# EAGLE design Controller_v4 (EAGLE 6.4)
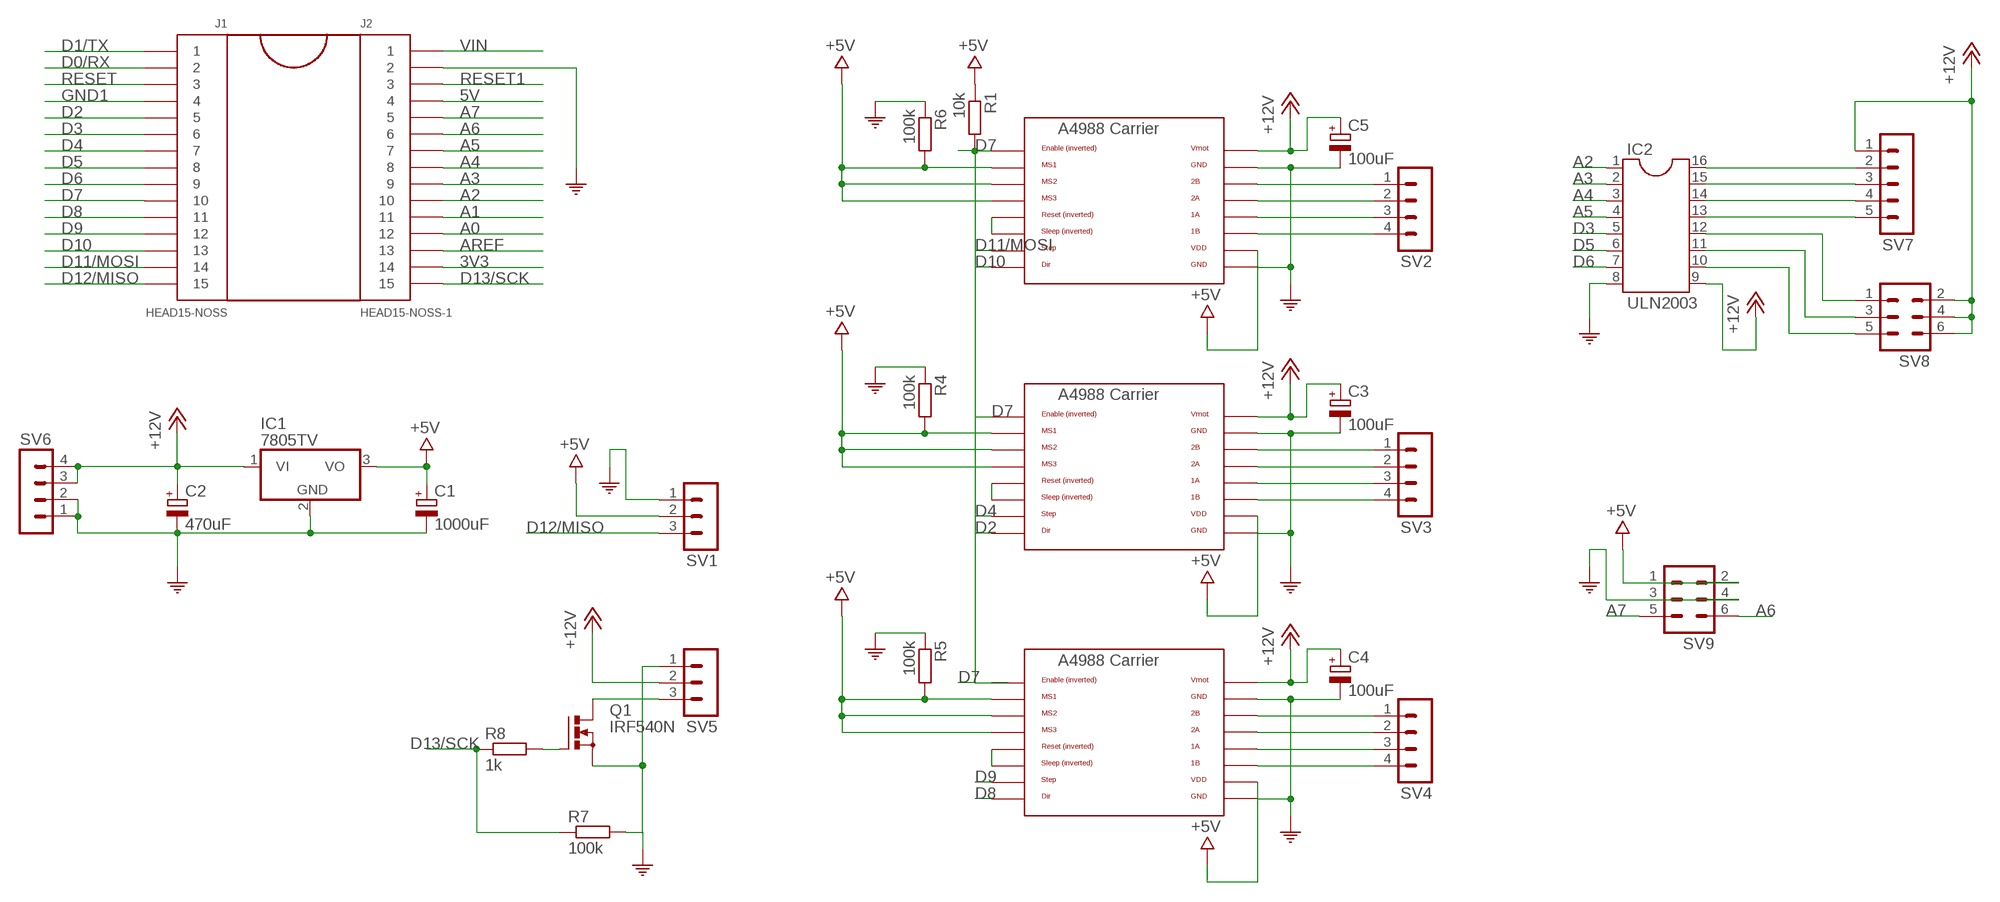
[diagram p0: schematic, sheet 1]

## Parts
C1  1000uF  CPOL-EUTAP5-70  [TAP5-70]
C2  470uF  CPOL-EUTAP5-70  [TAP5-70]
C3  100uF  CPOL-EUTAP5-70  [TAP5-70]
C4  100uF  CPOL-EUTAP5-70  [TAP5-70]
C5  100uF  CPOL-EUTAP5-70  [TAP5-70]
IC1  7805TV  [TO220V]
IC2  ULN2003  DIL16  [DIL16]
J1  HEAD15-NOSS  [HEAD15-NOSS]
J2  HEAD15-NOSS-1  [HEAD15-NOSS-1]
Q1  IRF540N  PMOSFET_NTO220BV  [TO220BV]
R1  10k  R-EU_0207/10  [0207/10]
R4  100k  R-EU_0207/10  [0207/10]
R5  100k  R-EU_0207/10  [0207/10]
R6  100k  R-EU_0207/10  [0207/10]
R7  100k  R-EU_0207/10  [0207/10]
R8  1k  R-EU_0207/10  [0207/10]
SV1  MA03-1  [MA03-1]
SV2  MA04-1  [MA04-1]
SV3  MA04-1  [MA04-1]
SV4  MA04-1  [MA04-1]
SV5  MA03-1  [MA03-1]
SV6  MA04-1  [MA04-1]
SV7  MA05-1  [MA05-1]
SV8  MA03-2  [MA03-2]
SV9  MA03-2  [MA03-2]
U$3  A4988BREAKOUT  [A4988BREAKOUT]
U$4  A4988BREAKOUT  [A4988BREAKOUT]
U$5  A4988BREAKOUT  [A4988BREAKOUT]

## Nets
3V3: J2.14
5V: J2.4
+5V: C1.+ IC1.3(VO) R1.1 R4.2 R5.2 R6.2 SV1.2 SV9.1 SV9.2 U$3.MS1 U$3.MS2 U$3.MS3 U$3.VDD U$4.MS1 U$4.MS2 U$4.MS3 U$4.VDD U$5.MS1 U$5.MS2 U$5.MS3 U$5.VDD
+12V: C2.+ C3.+ C4.+ C5.+ IC1.1(VI) IC2.9 SV5.2 SV6.3 SV6.4 SV7.1 SV8.2 SV8.4 SV8.6 U$3.VMOT U$4.VMOT U$5.VMOT
A0: J2.12
A1: J2.11
A2: IC2.1 J2.10
A3: IC2.2 J2.9
A4: IC2.3 J2.8
A5: IC2.4 J2.7
A6: J2.6 SV9.6
A7: J2.5 SV9.5
AREF: J2.13
COM: C1.- C2.- C3.- C4.- C5.- IC1.2(GND) IC2.8 J2.2 Q1.S R4.1 R5.1 R6.1 R7.2 SV1.1 SV5.1 SV6.1 SV6.2 SV9.3 SV9.4 U$3.GND U$3.GND@0(GND) U$4.GND U$4.GND@0(GND) U$5.GND U$5.GND@0(GND)
D0/RX: J1.2
D1/TX: J1.1
D2: J1.5 U$5.DIR
D3: IC2.5 J1.6
D4: J1.7 U$5.STEP
D5: IC2.6 J1.8
D6: IC2.7 J1.9
D7: J1.10 R1.2 U$3.EN U$4.EN U$5.EN
D8: J1.11 U$4.DIR
D9: J1.12 U$4.STEP
D10: J1.13 U$3.DIR
D11/MOSI: J1.14 U$3.STEP
D12/MISO: J1.15 SV1.3
D13/SCK: J2.15 R7.1 R8.1
GND1: J1.4
N$4: U$4.RST U$4.SLP(SLEEP)
N$5: SV2.1 U$3.2B
N$6: U$3.RST U$3.SLP(SLEEP)
N$7: U$5.RST U$5.SLP(SLEEP)
N$8: SV2.2 U$3.2A
N$10: SV2.3 U$3.1A
N$11: SV2.4 U$3.1B
N$12: SV3.1 U$5.2B
N$13: SV3.2 U$5.2A
N$14: SV3.3 U$5.1A
N$15: SV3.4 U$5.1B
N$16: SV4.1 U$4.2B
N$17: SV4.2 U$4.2A
N$18: SV4.3 U$4.1A
N$19: SV4.4 U$4.1B
N$20: Q1.D SV5.3
N$21: Q1.G R8.2
N$22: IC2.16 SV7.2
N$23: IC2.15 SV7.3
N$29: IC2.14 SV7.4
N$30: IC2.13 SV7.5
N$31: IC2.12 SV8.1
N$32: IC2.11 SV8.3
N$33: IC2.10 SV8.5
RESET: J1.3
RESET1: J2.3
VIN: J2.1

## Library data of the parts
C1-C5 = resistor:CPOL-EU: POLARIZED CAPACITOR, European symbol
IC1 = linear:78*: Positive VOLTAGE REGULATOR Source: http://cache.national.com/ds/LM/LM78L05.pdf http://www.fairchildsemi.com/ds/LM/LM7805.pdf
IC2 = ic-package:DIL16: Dual In Line / Socket
J1 = MyCON2:HEAD15-NOSS
J2 = MyCON2:HEAD15-NOSS-1
Q1 = transistor-power:PMOSFET_N: Power MOSFET N-Channel
R1 R4-R8 = resistor:R-EU_: RESISTOR, European symbol
SV1 SV5 = con-lstb:MA03-1: PIN HEADER; OC_FARNELL: unknown; OC_NEWARK: unknown
SV2-SV4 SV6 = con-lstb:MA04-1: PIN HEADER; OC_FARNELL: unknown; OC_NEWARK: unknown
SV7 = con-lstb:MA05-1: PIN HEADER; OC_FARNELL: unknown; OC_NEWARK: unknown
SV8 SV9 = con-lstb:MA03-2: PIN HEADER; OC_FARNELL: unknown; OC_NEWARK: unknown
U$3-U$5 = RepRapjr:A4988BREAKOUT

## Board
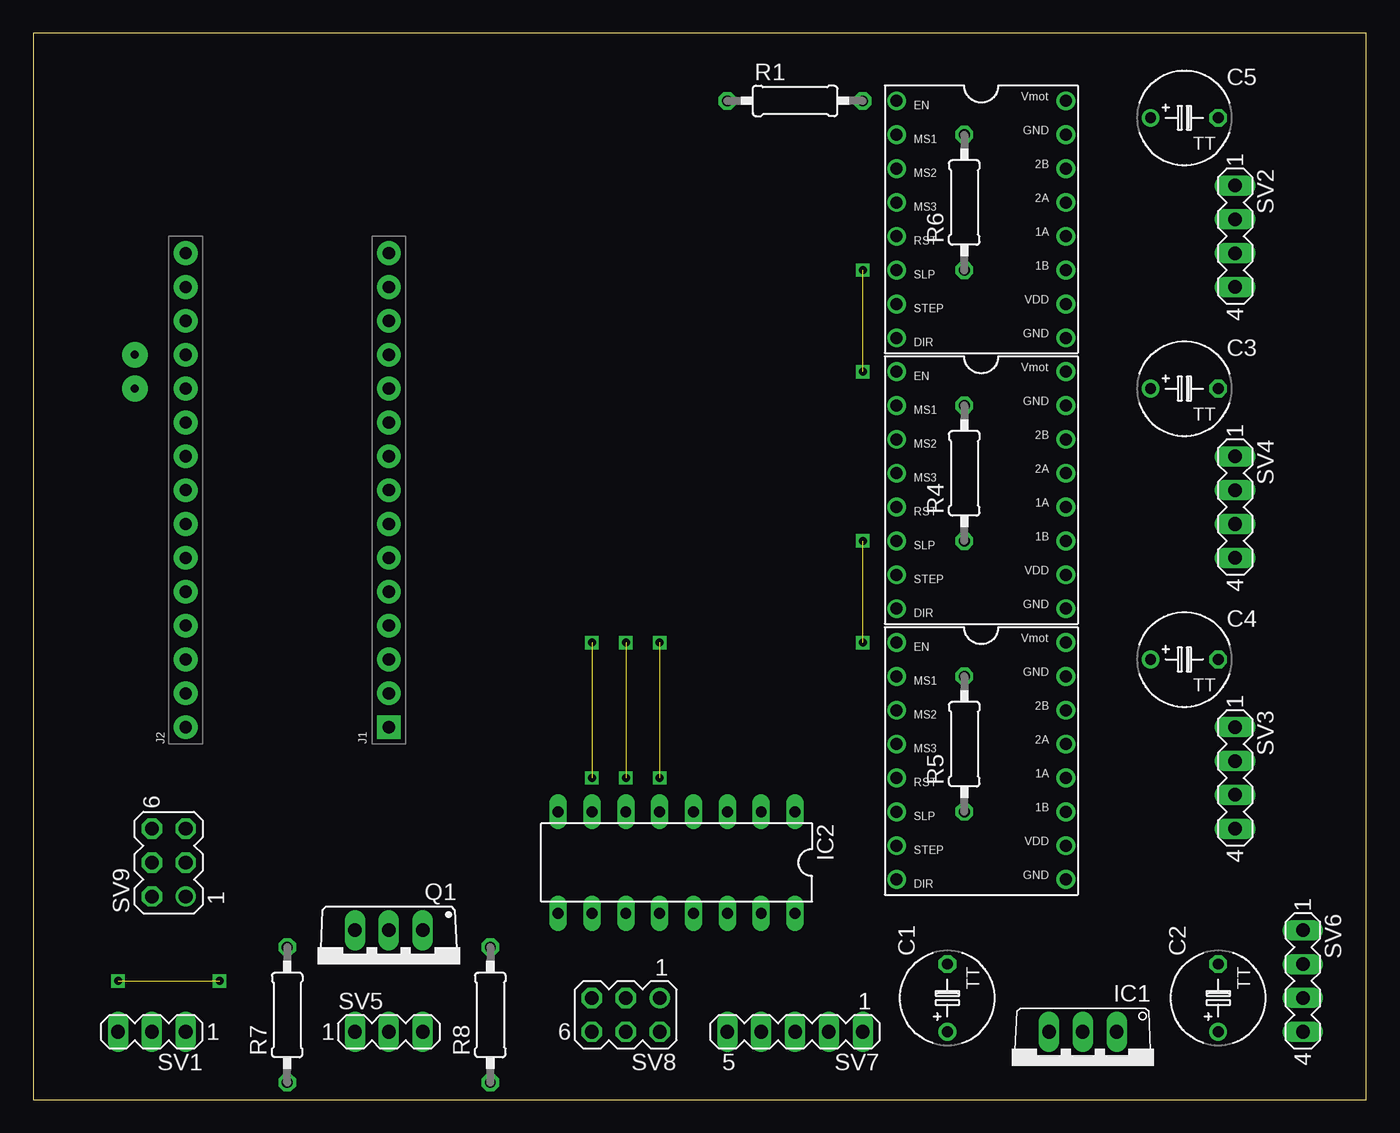
[diagram p1: board, top side]
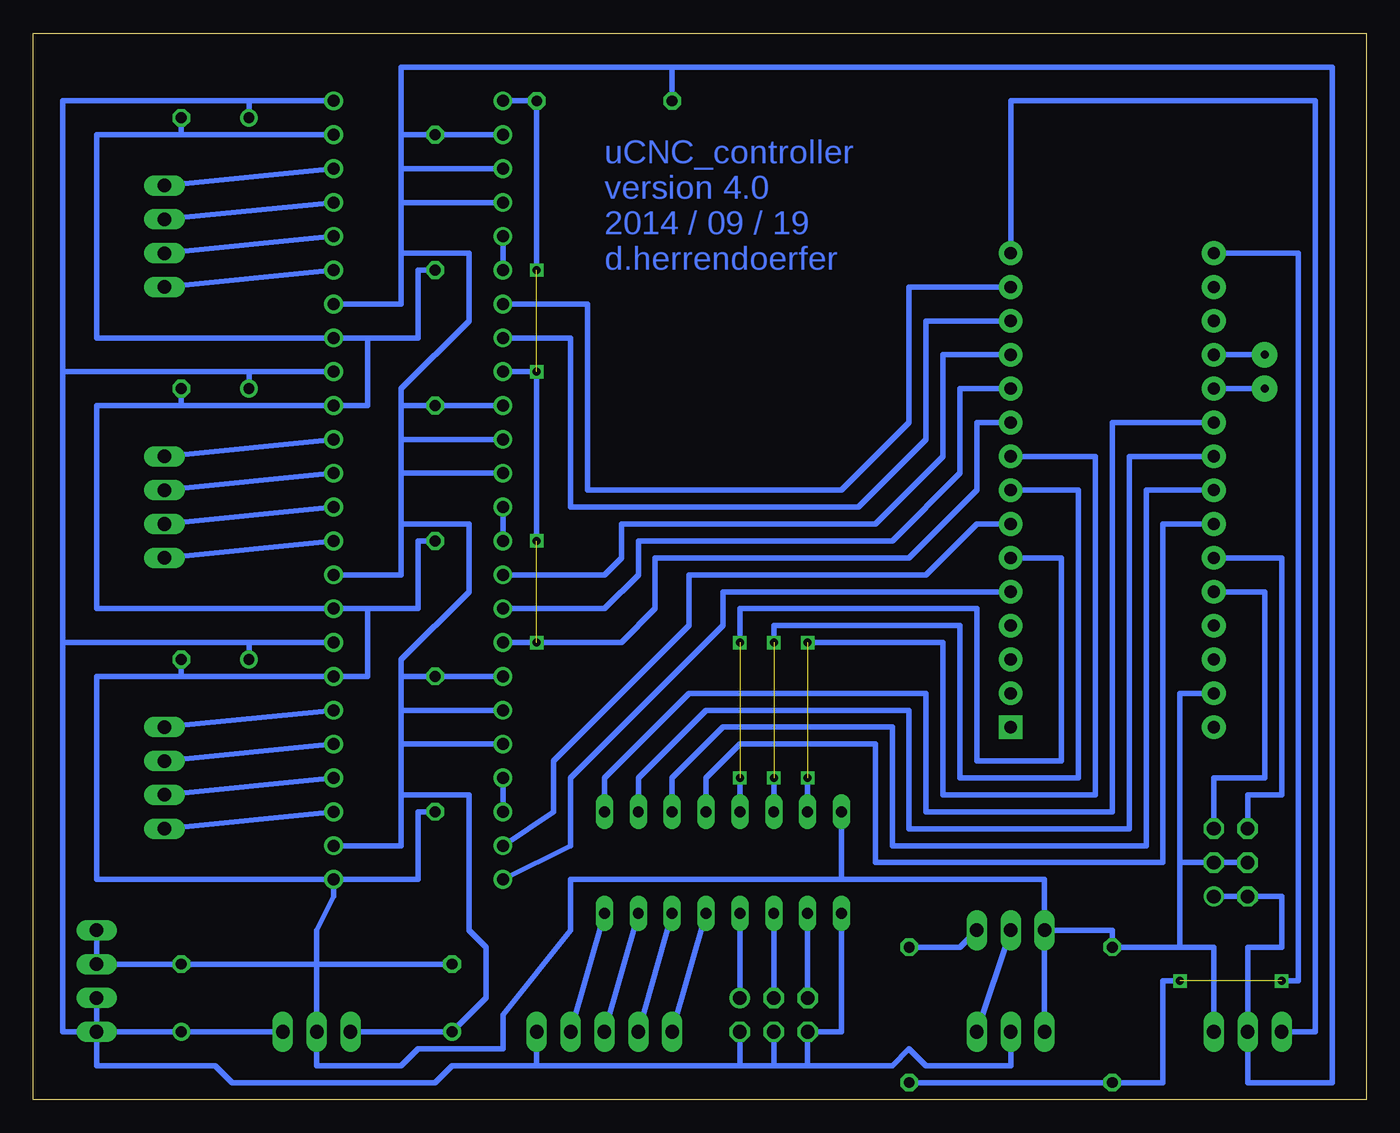
[diagram p2: board, bottom side, seen from below]

Size 100 x 80 mm. Coordinates in mm from the lower left corner, seen from the top.
Outline: 0,0 100,0 100,80 0,80 0,0
Copper layers (1*16): Top 0.035mm / dielectric 1.5mm / Bottom 0.035mm
Design rules "default": minimum track width 10mil, minimum drill 24mil, track to track 8mil, track to pad 8mil, pad to pad 8mil, via to via 8mil, smd to smd 8mil, copper to edge 40mil, drill to drill 8mil, minimum pad ring 10mil, minimum via ring 8mil, stop-mask expansion 4mil, vias tented up to drill 0mil, thermal gap 10mil

### Footprints (pad centres in the part's own frame; a part is rotated, then mirrored left to right if it is on the bottom)
TAP5-70 = drill 0.813: + -2.54,0 | drill 0.813 octagon: - 2.54,0
TO220V = drill 1.016 long: 1 -2.54,-2.54; 2 0,-2.54; 3 2.54,-2.54
DIL16 = drill 0.813 long: 1 -8.89,-3.81; 2 -6.35,-3.81; 3 -3.81,-3.81; 4 -1.27,-3.81; 5 1.27,-3.81; 6 3.81,-3.81; 7 6.35,-3.81; 8 8.89,-3.81; 9 8.89,3.81; 10 6.35,3.81; 11 3.81,3.81; 12 1.27,3.81; 13 -1.27,3.81; 14 -3.81,3.81; 15 -6.35,3.81; 16 -8.89,3.81
HEAD15-NOSS = drill 0.914 pad 1.778 square: 1 0,0 | drill 0.914 pad 1.778: 2 2.54,0; 3 5.08,0; 4 7.62,0; 5 10.16,0; 6 12.7,0; 7 15.24,0; 8 17.78,0; 9 20.32,0; 10 22.86,0; 11 25.4,0; 12 27.94,0; 13 30.48,0; 14 33.02,0; 15 35.56,0
HEAD15-NOSS-1 = drill 0.914 pad 1.778: 1 0,0; 2 2.54,0; 3 5.08,0; 4 7.62,0; 5 10.16,0; 6 12.7,0; 7 15.24,0; 8 17.78,0; 9 20.32,0; 10 22.86,0; 11 25.4,0; 12 27.94,0; 13 30.48,0; 14 33.02,0; 15 35.56,0
TO220BV = drill 1.016 long: D 0,-2.54; G -2.54,-2.54; S 2.54,-2.54
0207/10 = drill 0.813 octagon: 1 -5.08,0; 2 5.08,0
MA03-1 = drill 1.016 long: 1 -2.54,0; 2 0,0; 3 2.54,0
MA04-1 = drill 1.016 long: 1 -3.81,0; 2 -1.27,0; 3 1.27,0; 4 3.81,0
MA05-1 = drill 1.016 long: 1 -5.08,0; 2 -2.54,0; 3 0,0; 4 2.54,0; 5 5.08,0
MA03-2 = drill 1.016: 1 -2.54,-1.27 | drill 1.016 octagon: 2 -2.54,1.27; 3 0,-1.27; 4 0,1.27; 5 2.54,-1.27; 6 2.54,1.27
A4988BREAKOUT = drill 0.9: 1A 8.89,1.27; 1B 11.43,1.27; 2A 6.35,1.27; 2B 3.81,1.27; DIR 16.51,-11.43; EN -1.27,-11.43; GND 16.51,1.27; GND@0 1.27,1.27; MS1 1.27,-11.43; MS2 3.81,-11.43; MS3 6.35,-11.43; RST 8.89,-11.43; SLP 11.43,-11.43; STEP 13.97,-11.43; VDD 13.97,1.27; VMOT -1.27,1.27

### Placement (x,y rotation side)
C1  68.58,7.62 90 top
C2  88.9,7.62 90 top
C3  86.36,53.34 0 top
C4  86.36,33.02 0 top
C5  86.36,73.66 0 top
IC1  78.74,2.54 180 top
IC2  48.26,17.78 180 top
J1  26.67,27.94 90 top
J2  11.43,27.94 90 top
Q1  26.67,10.16 180 top
R1  57.15,74.93 0 top
R4  69.85,46.99 90 top
R5  69.85,26.67 90 top
R6  69.85,67.31 90 top
R7  19.05,6.35 90 top
R8  34.29,6.35 90 top
SV1  8.89,5.08 180 top
SV2  90.17,64.77 270 top
SV3  90.17,24.13 270 top
SV4  90.17,44.45 270 top
SV5  26.67,5.08 0 top
SV6  95.25,8.89 270 top
SV7  57.15,5.08 180 top
SV8  44.45,6.35 180 top
SV9  10.16,17.78 90 top
U$3  76.2,73.66 270 top
U$4  76.2,53.34 270 top
U$5  76.2,33.02 270 top

### Tracks (layer width: path | path; a pad name or v marks a point on that pad's centre or on a via)
+5V
  Bottom 0.406: IC1.3 C1.+ 66.04,7.62 66.04,11.43 67.31,12.7 67.31,22.86 72.39,22.86 | U$5.MS1 R5.2 72.39,31.75 | 72.39,31.75 72.39,29.21 | 72.39,29.21 72.39,26.67 | 72.39,26.67 72.39,22.86 | 72.39,22.86 72.39,19.05 U$5.VDD | U$5.MS2 72.39,29.21 | U$5.MS3 72.39,26.67 | U$4.MS1 R4.2 72.39,52.07 | 72.39,52.07 72.39,49.53 | 72.39,49.53 72.39,46.99 | 72.39,46.99 72.39,43.18 | 72.39,43.18 72.39,39.37 U$4.VDD | U$4.MS2 72.39,49.53 | U$4.MS3 72.39,46.99 | U$3.VDD 72.39,59.69 72.39,63.5 | 72.39,63.5 72.39,67.31 | 72.39,67.31 72.39,69.85 | 72.39,69.85 72.39,72.39 | 72.39,72.39 R6.2 U$3.MS1 | U$3.MS2 72.39,69.85 | U$3.MS3 72.39,67.31 | 72.39,63.5 67.31,63.5 67.31,58.42 72.39,53.34 72.39,52.07 | 72.39,43.18 67.31,43.18 67.31,38.1 72.39,33.02 72.39,31.75 | 52.07,77.47 R1.1 | 72.39,72.39 72.39,77.47 52.07,77.47 | 52.07,77.47 2.54,77.47 2.54,1.27 8.89,1.27 SV1.2 8.89,11.43 6.35,11.43 6.35,15.24 SV9.2 SV9.1
+12V
  Bottom 0.406: U$3.VMOT 83.82,74.93 | 83.82,74.93 C5.+ | U$4.VMOT 83.82,54.61 | 83.82,54.61 C3.+ | U$5.VMOT 83.82,34.29 | 83.82,34.29 C4.+ | IC1.1 C2.+ SV6.4 | SV6.4 SV6.3 | 83.82,74.93 97.79,74.93 97.79,54.61 | 97.79,54.61 97.79,34.29 | 97.79,34.29 97.79,5.08 SV6.4 | 83.82,54.61 97.79,54.61 | 83.82,34.29 97.79,34.29 | SV6.4 95.25,2.54 86.36,2.54 85.09,1.27 69.85,1.27 68.58,2.54 62.23,2.54 | 62.23,2.54 SV7.1 | 62.23,2.54 46.99,2.54 | 46.99,2.54 44.45,2.54 | 41.91,2.54 SV8.6 39.37,5.08 IC2.9 | 41.91,2.54 44.45,2.54 | 44.45,2.54 SV8.4 | 46.99,2.54 SV8.2 | SV5.2 26.67,2.54 33.02,2.54 34.29,3.81 35.56,2.54 41.91,2.54
A0  (via drill 0.6 pad 1.93)
  Bottom 0.406: v7.62,55.88 J2.12
A1  (via drill 0.6 pad 1.93)
  Bottom 0.406: v7.62,53.34 J2.11
A2
  Bottom 0.406: J2.10 19.05,50.8 19.05,21.59 33.02,21.59 33.02,30.48 50.8,30.48 57.15,24.13 IC2.1
A3
  Bottom 0.406: J2.9 17.78,48.26 17.78,20.32 34.29,20.32 34.29,29.21 49.53,29.21 54.61,24.13 IC2.2
A4
  Bottom 0.406: J2.8 16.51,45.72 16.51,19.05 35.56,19.05 35.56,27.94 48.26,27.94 52.07,24.13 IC2.3
A5
  Bottom 0.406: J2.7 15.24,43.18 15.24,17.78 36.83,17.78 36.83,26.67 46.99,26.67 49.53,24.13 IC2.4
A6
  Bottom 0.406: J2.6 6.35,40.64 6.35,22.86 8.89,22.86 SV9.6
A7
  Bottom 0.406: SV9.5 11.43,24.13 7.62,24.13 7.62,38.1 J2.5
COM
  Bottom 0.406: U$3.GND@0 88.9,72.39 | 88.9,72.39 C5.- | 88.9,52.07 U$4.GND@0 74.93,52.07 74.93,57.15 | 88.9,52.07 C3.- | 88.9,31.75 U$5.GND@0 74.93,31.75 74.93,36.83 | 88.9,31.75 C4.- | C1.- 78.74,10.16 | 78.74,10.16 C2.- SV6.2 SV6.1 | 78.74,10.16 IC1.2 78.74,2.54 72.39,2.54 71.12,3.81 64.77,3.81 64.77,6.35 59.69,12.7 59.69,16.51 39.37,16.51 | U$5.GND 71.12,16.51 71.12,21.59 R5.1 | 88.9,72.39 95.25,72.39 95.25,57.15 U$3.GND 74.93,57.15 | 88.9,52.07 95.25,52.07 95.25,36.83 U$4.GND 74.93,36.83 | 88.9,31.75 95.25,31.75 95.25,16.51 U$5.GND | 74.93,36.83 71.12,36.83 71.12,41.91 R4.1 | R6.1 71.12,62.23 71.12,57.15 74.93,57.15 | 78.74,10.16 78.74,12.7 77.47,15.24 U$5.GND | Q1.S SV5.1 | Q1.S 24.13,16.51 39.37,16.51 | 39.37,16.51 IC2.8 | Q1.S 19.05,12.7 R7.2 13.97,11.43 | SV1.1 11.43,11.43 13.97,11.43 | J2.2 13.97,30.48 13.97,17.78 | 13.97,17.78 13.97,11.43 | 13.97,17.78 SV9.3 SV9.4
D2
  Bottom 0.406: J1.5 48.26,38.1 48.26,35.56 59.69,24.13 59.69,19.05 U$5.DIR
D3  (via drill 0.6)  (1 unrouted)
  Bottom 0.406: J1.6 22.86,40.64 22.86,25.4 29.21,25.4 29.21,36.83 46.99,36.83 v46.99,34.29 | IC2.5 v46.99,24.13
D4
  Bottom 0.406: J1.7 29.21,43.18 33.02,39.37 50.8,39.37 50.8,35.56 60.96,25.4 60.96,21.59 U$5.STEP
D5  (via drill 0.6)  (1 unrouted)
  Bottom 0.406: J1.8 21.59,45.72 21.59,24.13 30.48,24.13 30.48,35.56 44.45,35.56 v44.45,34.29 | IC2.6 v44.45,24.13
D6  (via drill 0.6)  (1 unrouted)
  Bottom 0.406: J1.9 20.32,48.26 20.32,22.86 31.75,22.86 31.75,34.29 v41.91,34.29 | IC2.7 v41.91,24.13
D7  (via drill 0.6)  (2 unrouted)
  Bottom 0.406: J1.10 29.21,50.8 29.21,45.72 34.29,40.64 53.34,40.64 53.34,36.83 55.88,34.29 v62.23,34.29 U$5.EN | U$3.EN R1.2 v62.23,62.23 | U$4.EN v62.23,54.61 v62.23,41.91
D8
  Bottom 0.406: J1.11 30.48,53.34 30.48,46.99 35.56,41.91 54.61,41.91 54.61,39.37 57.15,36.83 U$4.DIR
D9
  Bottom 0.406: U$4.STEP 57.15,39.37 55.88,40.64 55.88,43.18 36.83,43.18 31.75,48.26 31.75,55.88 J1.12
D10
  Bottom 0.406: J1.13 33.02,58.42 33.02,49.53 38.1,44.45 59.69,44.45 59.69,57.15 U$3.DIR
D11/MOSI
  Bottom 0.406: J1.14 34.29,60.96 34.29,50.8 39.37,45.72 58.42,45.72 58.42,59.69 U$3.STEP
D12/MISO
  Bottom 0.406: SV1.3 3.81,5.08 3.81,74.93 26.67,74.93 J1.15
D13/SCK  (via drill 0.6)  (1 unrouted)
  Bottom 0.406: R8.1 R7.1 15.24,1.27 15.24,8.89 v13.97,8.89 | J2.15 5.08,63.5 5.08,8.89 v6.35,8.89
N$4
  Bottom 0.406: U$4.RST U$4.SLP
N$5
  Bottom 0.406: U$3.2B SV2.1
N$6
  Bottom 0.406: U$3.RST U$3.SLP
N$7
  Bottom 0.406: U$5.SLP U$5.RST
N$8
  Bottom 0.406: U$3.2A SV2.2
N$10
  Bottom 0.406: U$3.1A SV2.3
N$11
  Bottom 0.406: U$3.1B SV2.4
N$12
  Bottom 0.406: U$5.2B SV3.1
N$13
  Bottom 0.406: U$5.2A SV3.2
N$14
  Bottom 0.406: U$5.1A SV3.3
N$15
  Bottom 0.406: U$5.1B SV3.4
N$16
  Bottom 0.406: U$4.2B SV4.1
N$17
  Bottom 0.406: U$4.2A SV4.2
N$18
  Bottom 0.406: U$4.1A SV4.3
N$19
  Bottom 0.406: U$4.1B SV4.4
N$20
  Bottom 0.406: SV5.3 Q1.D
N$21
  Bottom 0.406: Q1.G 30.48,11.43 R8.2
N$22
  Bottom 0.406: IC2.16 SV7.2
N$23
  Bottom 0.406: IC2.15 SV7.3
N$29
  Bottom 0.406: IC2.14 SV7.4
N$30
  Bottom 0.406: IC2.13 SV7.5
N$31
  Bottom 0.406: IC2.12 SV8.1
N$32
  Bottom 0.406: IC2.11 SV8.3
N$33
  Bottom 0.406: IC2.10 SV8.5

### Text on the board
Bottom: uCNC_controller / version 4.0 / 2014 / 09 / 19 / d.herrendoerfer